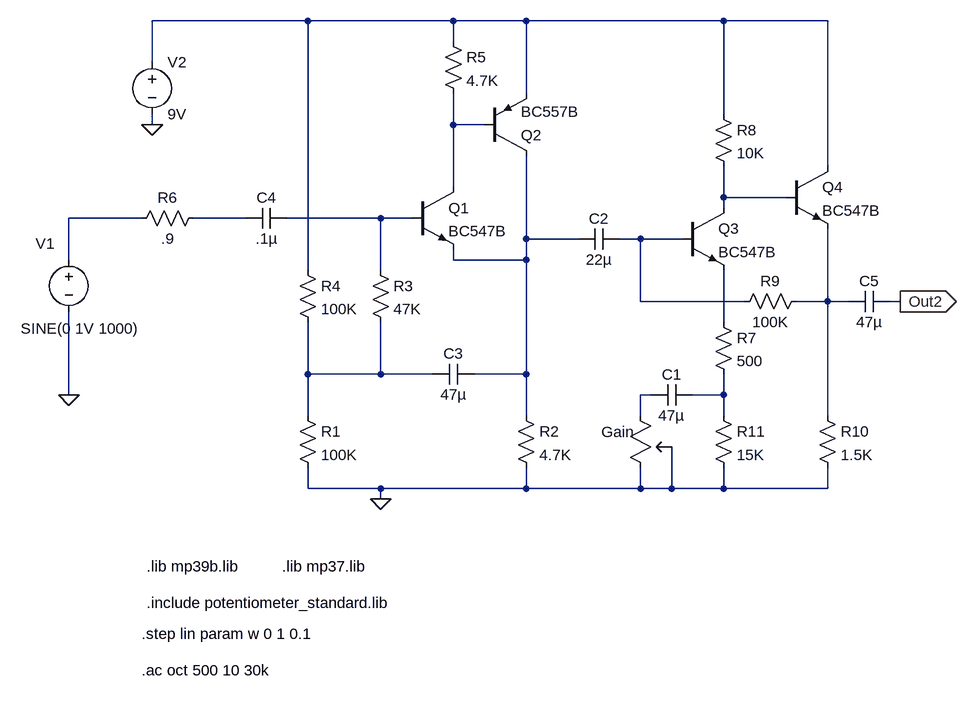
[diagram p0: schematic clean-preamp v2 npn.asc]
clean-preamp v2 npn.asc, the LTspice schematic file:
Version 4
SHEET 1 880 680
WIRE -1184 -992 -1424 -992
WIRE -960 -992 -1184 -992
WIRE -848 -992 -960 -992
WIRE -544 -992 -848 -992
WIRE -384 -992 -544 -992
WIRE -960 -960 -960 -992
WIRE -1424 -928 -1424 -992
WIRE -848 -880 -848 -992
WIRE -544 -848 -544 -992
WIRE -1424 -832 -1424 -848
WIRE -960 -832 -960 -880
WIRE -912 -832 -960 -832
WIRE -384 -768 -384 -992
WIRE -960 -736 -960 -832
WIRE -544 -720 -544 -768
WIRE -448 -720 -544 -720
WIRE -544 -704 -544 -720
WIRE -1440 -688 -1552 -688
WIRE -1280 -688 -1360 -688
WIRE -1072 -688 -1216 -688
WIRE -1024 -688 -1072 -688
WIRE -848 -656 -848 -784
WIRE -768 -656 -848 -656
WIRE -672 -656 -704 -656
WIRE -608 -656 -672 -656
WIRE -1552 -624 -1552 -688
WIRE -960 -624 -960 -640
WIRE -848 -624 -848 -656
WIRE -848 -624 -960 -624
WIRE -1184 -608 -1184 -992
WIRE -1072 -608 -1072 -688
WIRE -672 -560 -672 -656
WIRE -512 -560 -672 -560
WIRE -384 -560 -384 -672
WIRE -384 -560 -432 -560
WIRE -352 -560 -384 -560
WIRE -272 -560 -288 -560
WIRE -544 -528 -544 -608
WIRE -1184 -448 -1184 -528
WIRE -1072 -448 -1072 -528
WIRE -1072 -448 -1184 -448
WIRE -992 -448 -1072 -448
WIRE -848 -448 -848 -624
WIRE -848 -448 -928 -448
WIRE -1552 -416 -1552 -544
WIRE -656 -416 -672 -416
WIRE -544 -416 -544 -448
WIRE -544 -416 -592 -416
WIRE -1184 -384 -1184 -448
WIRE -848 -384 -848 -448
WIRE -672 -384 -672 -416
WIRE -544 -384 -544 -416
WIRE -384 -384 -384 -560
WIRE -1184 -272 -1184 -304
WIRE -1072 -272 -1184 -272
WIRE -848 -272 -848 -304
WIRE -848 -272 -1072 -272
WIRE -672 -272 -672 -304
WIRE -672 -272 -848 -272
WIRE -624 -272 -624 -336
WIRE -624 -272 -672 -272
WIRE -544 -272 -544 -304
WIRE -544 -272 -624 -272
WIRE -384 -272 -384 -304
WIRE -384 -272 -544 -272
WIRE -1072 -256 -1072 -272
FLAG -1552 -416 0
FLAG -1424 -832 0
FLAG -1072 -256 0
FLAG -272 -560 Out2
IOPIN -272 -560 Out
SYMBOL voltage -1552 -640 R0
WINDOW 39 -112 95 Left 2
WINDOW 3 -74 122 Left 2
WINDOW 0 -51 -9 Left 2
SYMATTR Value SINE(0 1V 1000)
SYMATTR InstName V1
SYMATTR Value2 AC 1
SYMBOL voltage -1424 -944 R0
WINDOW 123 0 0 Left 2
WINDOW 39 24 -12 Left 2
SYMATTR InstName V2
SYMATTR Value 9V
SYMBOL res -1200 -400 R0
SYMATTR InstName R1
SYMATTR Value 100K
SYMBOL cap -704 -672 R90
WINDOW 0 0 32 VBottom 2
WINDOW 3 32 32 VTop 2
SYMATTR InstName C2
SYMATTR Value 22µ
SYMBOL res -864 -400 R0
SYMATTR InstName R2
SYMATTR Value 4.7K
SYMBOL cap -928 -464 R90
WINDOW 0 0 32 VBottom 2
WINDOW 3 32 32 VTop 2
SYMATTR InstName C3
SYMATTR Value 47µ
SYMBOL res -1088 -624 R0
SYMATTR InstName R3
SYMATTR Value 47K
SYMBOL res -1200 -624 R0
SYMATTR InstName R4
SYMATTR Value 100K
SYMBOL cap -1216 -704 R90
WINDOW 0 0 32 VBottom 2
WINDOW 3 32 32 VTop 2
SYMATTR InstName C4
SYMATTR Value .1µ
SYMBOL res -1344 -704 R90
WINDOW 0 0 56 VBottom 2
WINDOW 3 32 56 VTop 2
SYMATTR InstName R6
SYMATTR Value .9
SYMBOL res -976 -976 R0
SYMATTR InstName R5
SYMATTR Value 4.7K
SYMBOL potentiometer_standard -688 -400 R0
WINDOW 0 -44 41 Left 2
WINDOW 3 -201 26 Invisible 2
SYMATTR InstName Gain
SYMATTR Value Rtot=10K wiper=1-{w}
SYMATTR SpiceModel pot_lin
SYMBOL pnp -912 -784 M180
SYMATTR InstName Q2
SYMATTR Value BC557B
SYMBOL res -560 -864 R0
SYMATTR InstName R8
SYMATTR Value 10K
SYMBOL res -416 -576 R90
WINDOW 0 0 56 VBottom 2
WINDOW 3 32 56 VTop 2
SYMATTR InstName R9
SYMATTR Value 100K
SYMBOL res -400 -400 R0
SYMATTR InstName R10
SYMATTR Value 1.5K
SYMBOL res -560 -400 R0
SYMATTR InstName R11
SYMATTR Value 15K
SYMBOL cap -288 -576 R90
WINDOW 0 0 32 VBottom 2
WINDOW 3 32 32 VTop 2
SYMATTR InstName C5
SYMATTR Value 47µ
SYMBOL cap -656 -400 R270
WINDOW 0 32 32 VTop 2
WINDOW 3 0 32 VBottom 2
SYMATTR InstName C1
SYMATTR Value 47µ
SYMBOL res -560 -544 R0
SYMATTR InstName R7
SYMATTR Value 500
SYMBOL npn -1024 -736 R0
SYMATTR InstName Q1
SYMATTR Value BC547B
SYMBOL npn -608 -704 R0
SYMATTR InstName Q3
SYMATTR Value BC547B
SYMBOL npn -448 -768 R0
SYMATTR InstName Q4
SYMATTR Value BC547B
TEXT -1432 -152 Left 2 !.lib mp39b.lib
TEXT -1224 -152 Left 2 !.lib mp37.lib
TEXT -1432 -96 Left 2 !.include potentiometer_standard.lib
TEXT -1440 -48 Left 2 !.step lin param w 0 1 0.1
TEXT -1440 8 Left 2 !.ac oct 500 10 30k

The netlist it stands for:
* clean-preamp v2 npn.asc
V1 N004 0 SINE(0 1V 1000) AC 1
V2 N001 0 9V
R1 N011 0 100K
C2 N008 N007 22µ
R2 N007 0 4.7K
C3 N007 N011 47µ
R3 N006 N011 47K
R4 N001 N011 100K
C4 N006 N005 .1µ
R6 N005 N004 .9
R5 N001 N002 4.7K
XGain N012 0 0 pot_lin Rtot=10K wiper=1-{w}  ; pins A B C
Q2 N007 N002 N001 0 BC557B
R8 N001 N003 10K
R9 N009 N008 100K
R10 N009 0 1.5K
R11 N013 0 15K
C5 Out2 N009 47µ
C1 N012 N013 47µ
R7 N010 N013 500
Q1 N002 N006 N007 0 BC547B
Q3 N003 N008 N010 0 BC547B
Q4 N001 N003 N009 0 BC547B
.model NPN NPN
.model PNP PNP
.lib standard.bjt
.lib mp39b.lib
.lib mp37.lib
.include potentiometer_standard.lib
.step lin param w 0 1 0.1
.ac oct 500 10 30k
.backanno
.end